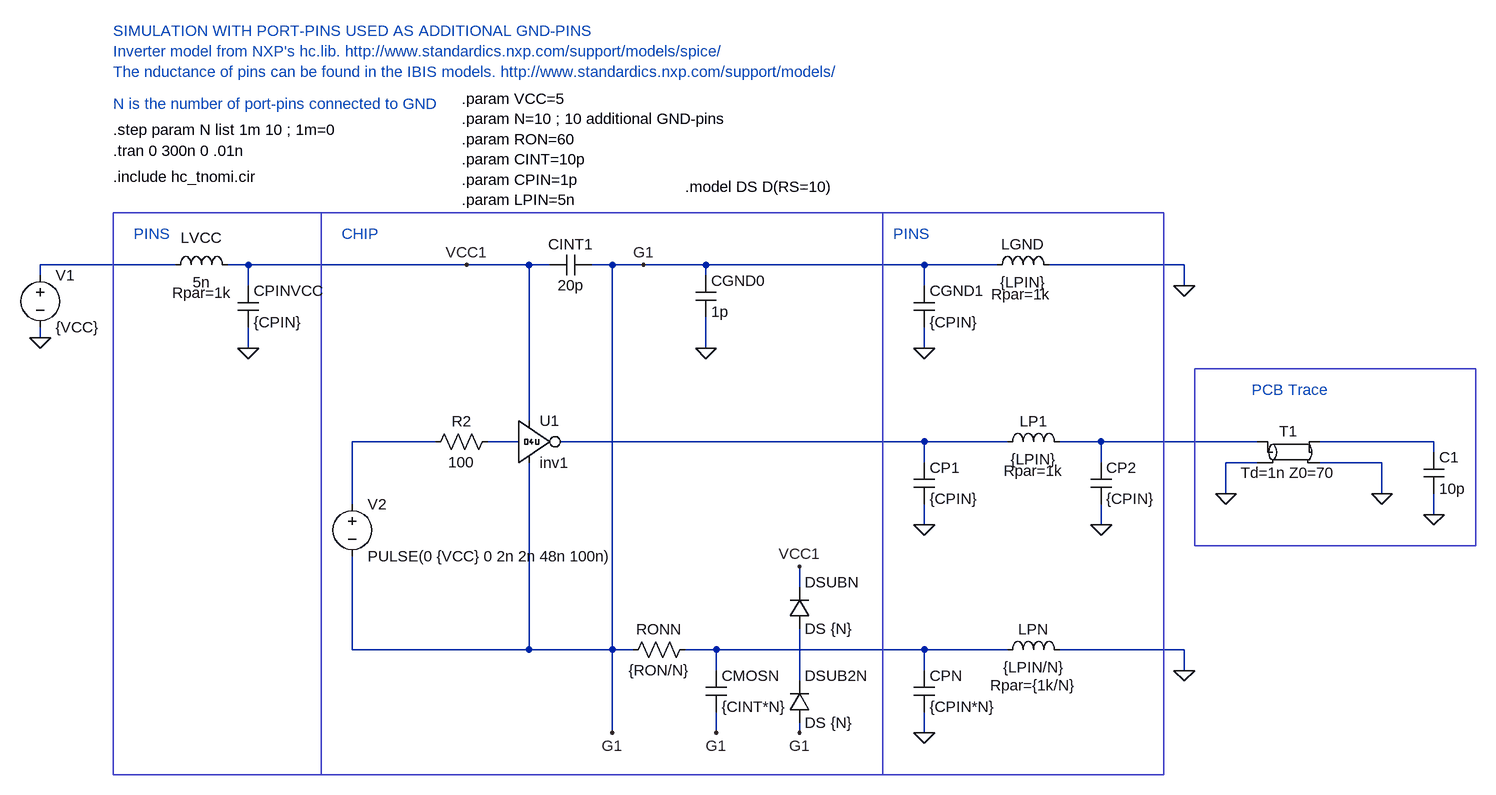
[diagram p0: schematic GND_port_pin_sim1.asc]
GND_port_pin_sim1.asc, the LTspice schematic file:
Version 4
SHEET 1 1284 1140
WIRE -720 -208 -928 -208
WIRE -608 -208 -640 -208
WIRE -272 -208 -608 -208
WIRE -176 -208 -272 -208
WIRE -144 -208 -176 -208
WIRE -48 -208 -80 -208
WIRE 0 -208 -48 -208
WIRE 96 -208 0 -208
WIRE 432 -208 96 -208
WIRE 544 -208 432 -208
WIRE 832 -208 624 -208
WIRE -928 -192 -928 -208
WIRE 96 -192 96 -208
WIRE -608 -176 -608 -208
WIRE 432 -176 432 -208
WIRE 832 -176 832 -208
WIRE -928 -96 -928 -112
WIRE -608 -80 -608 -112
WIRE 96 -80 96 -128
WIRE 432 -80 432 -112
WIRE -176 32 -176 -208
WIRE -320 64 -448 64
WIRE -192 64 -240 64
WIRE 432 64 -128 64
WIRE 560 64 432 64
WIRE 704 64 640 64
WIRE 944 64 704 64
WIRE 1216 64 1040 64
WIRE 1216 80 1216 64
WIRE 432 96 432 64
WIRE 704 96 704 64
WIRE 944 96 896 96
WIRE 1136 96 1040 96
WIRE 896 144 896 96
WIRE 1136 144 1136 96
WIRE -448 160 -448 64
WIRE 1216 176 1216 144
WIRE 432 192 432 160
WIRE 704 192 704 160
WIRE 240 288 240 256
WIRE -448 384 -448 240
WIRE -176 384 -176 96
WIRE -176 384 -448 384
WIRE -48 384 -48 -208
WIRE -48 384 -176 384
WIRE -16 384 -48 384
WIRE 112 384 64 384
WIRE 432 384 112 384
WIRE 560 384 432 384
WIRE 832 384 640 384
WIRE 112 416 112 384
WIRE 432 416 432 384
WIRE 832 416 832 384
WIRE 240 432 240 352
WIRE -48 512 -48 384
WIRE 112 512 112 480
WIRE 240 512 240 496
WIRE 432 512 432 480
FLAG 896 144 0
FLAG 1136 144 0
FLAG 1216 176 0
FLAG 832 -176 0
FLAG -928 -96 0
FLAG 96 -80 0
FLAG 432 512 0
FLAG 832 416 0
FLAG 112 512 G1
FLAG -48 512 G1
FLAG 704 192 0
FLAG 432 -80 0
FLAG 432 192 0
FLAG -608 -80 0
FLAG -272 -208 VCC1
FLAG 0 -208 G1
FLAG 240 512 G1
FLAG 240 256 VCC1
SYMBOL ind 544 400 R270
WINDOW 0 32 56 VTop 0
WINDOW 3 5 56 VBottom 0
WINDOW 39 -23 56 VBottom 0
SYMATTR InstName LPN
SYMATTR Value {LPIN/N}
SYMATTR SpiceLine Rpar={1k/N}
SYMBOL ind 544 80 R270
WINDOW 0 32 56 VTop 0
WINDOW 3 5 56 VBottom 0
WINDOW 39 -44 56 VTop 0
SYMATTR InstName LP1
SYMATTR Value {LPIN}
SYMATTR SpiceLine Rpar=1k
SYMBOL ind 528 -192 R270
WINDOW 0 32 56 VTop 0
WINDOW 3 5 56 VBottom 0
WINDOW 39 -45 53 VTop 0
SYMATTR InstName LGND
SYMATTR Value {LPIN}
SYMATTR SpiceLine Rpar=1k
SYMBOL tline 992 80 R0
SYMATTR InstName T1
SYMATTR Value Td=1n Z0=70
SYMBOL cap 1200 80 R0
SYMATTR InstName C1
SYMATTR Value 10p
SYMBOL hc04 -192 64 R0
SYMATTR InstName U1
SYMBOL voltage -928 -208 R0
SYMATTR InstName V1
SYMATTR Value {VCC}
SYMBOL ind -736 -192 R270
WINDOW 0 42 56 VTop 0
WINDOW 3 5 56 VBottom 0
WINDOW 39 -42 57 VTop 0
SYMATTR InstName LVCC
SYMATTR Value 5n
SYMATTR SpiceLine Rpar=1k
SYMBOL voltage -448 144 R0
WINDOW 123 0 0 Left 0
WINDOW 39 0 0 Left 0
SYMATTR InstName V2
SYMATTR Value PULSE(0 {VCC} 0 2n 2n 48n 100n)
SYMBOL cap -144 -192 R270
WINDOW 0 32 32 VTop 0
WINDOW 3 0 32 VBottom 0
SYMATTR InstName CINT1
SYMATTR Value 20p
SYMBOL cap 80 -192 R0
SYMATTR InstName CGND0
SYMATTR Value 1p
SYMBOL res -32 400 R270
WINDOW 0 32 56 VTop 0
WINDOW 3 0 56 VBottom 0
SYMATTR InstName RONN
SYMATTR Value {RON/N}
SYMBOL cap 416 416 R0
SYMATTR InstName CPN
SYMATTR Value {CPIN*N}
SYMBOL cap 96 416 R0
SYMATTR InstName CMOSN
SYMATTR Value {CINT*N}
SYMBOL res -336 80 R270
WINDOW 0 32 56 VTop 0
WINDOW 3 0 56 VBottom 0
SYMATTR InstName R2
SYMATTR Value 100
SYMBOL cap 688 96 R0
SYMATTR InstName CP2
SYMATTR Value {CPIN}
SYMBOL cap 416 96 R0
SYMATTR InstName CP1
SYMATTR Value {CPIN}
SYMBOL cap 416 -176 R0
SYMATTR InstName CGND1
SYMATTR Value {CPIN}
SYMBOL cap -624 -176 R0
SYMATTR InstName CPINVCC
SYMATTR Value {CPIN}
SYMBOL diode 224 496 M180
WINDOW 0 24 72 Left 0
WINDOW 3 24 0 Left 0
SYMATTR InstName DSUB2N
SYMATTR Value DS {N}
SYMBOL diode 224 352 M180
WINDOW 0 24 72 Left 0
WINDOW 3 24 0 Left 0
SYMATTR InstName DSUBN
SYMATTR Value DS {N}
TEXT -816 -384 Left 0 !.tran 0 300n 0 .01n
TEXT 936 -16 Left 0 ;PCB Trace
TEXT -816 -344 Left 0 !.include hc_tnomi.cir
TEXT -280 -464 Left 0 !.param VCC=5\n.param N=10 ; 10 additional GND-pins\n.param RON=60\n.param CINT=10p\n.param CPIN=1p\n.param LPIN=5n
TEXT -816 -416 Left 0 !.step param N list 1m 10 ; 1m=0
TEXT -464 -256 Left 0 ;CHIP
TEXT -784 -256 Left 0 ;PINS
TEXT 384 -256 Left 0 ;PINS
TEXT 64 -328 Left 0 !.model DS D(RS=10)
TEXT -816 -568 Left 0 ;SIMULATION WITH PORT-PINS USED AS ADDITIONAL GND-PINS\nInverter model from NXP's hc.lib. http://www.standardics.nxp.com/support/models/spice/\nThe nductance of pins can be found in the IBIS models. http://www.standardics.nxp.com/support/models/
TEXT -816 -456 Left 0 ;N is the number of port-pins connected to GND
RECTANGLE Normal 1280 224 848 -48
RECTANGLE Normal 368 576 -496 -288
RECTANGLE Normal 800 576 368 -288
RECTANGLE Normal -816 576 -496 -288

The netlist it stands for:
* GND_port_pin_sim1.asc
LPN N007 0 {LPIN/N} Rpar={1k/N}
LP1 N004 N005 {LPIN} Rpar=1k
LGND G1 0 {LPIN} Rpar=1k
T1 N005 0 N006 0 Td=1n Z0=70
C1 N006 0 10p
XU1 N003 N004 VCC1 G1 inv1  ; pins in out vcc vss
V1 N001 0 {VCC}
LVCC N001 VCC1 5n Rpar=1k
V2 N002 G1 PULSE(0 {VCC} 0 2n 2n 48n 100n)
CINT1 VCC1 G1 20p
CGND0 G1 0 1p
RONN G1 N007 {RON/N}
CPN N007 0 {CPIN*N}
CMOSN N007 G1 {CINT*N}
R2 N002 N003 100
CP2 N005 0 {CPIN}
CP1 N004 0 {CPIN}
CGND1 G1 0 {CPIN}
CPINVCC VCC1 0 {CPIN}
DSUB2N G1 N008 DS {N}
DSUBN N008 VCC1 DS {N}
.model D D
.lib standard.dio
.tran 0 300n 0 .01n
* PCB Trace
.include hc_tnomi.cir
.param VCC=5
.param N=10 ; 10 additional GND-pins
.param RON=60
.param CINT=10p
.param CPIN=1p
.param LPIN=5n
.step param N list 1m 10 ; 1m=0
* CHIP
* PINS
* PINS
.model DS D(RS=10)
* SIMULATION WITH PORT-PINS USED AS ADDITIONAL GND-PINS
* Inverter model from NXP's hc.lib. http://www.standardics.nxp.com/support/models/spice/
* The nductance of pins can be found in the IBIS models. http://www.standardics.nxp.com/support/models/
* N is the number of port-pins connected to GND
.backanno
.end